# EAGLE design ControlLineSelector (EAGLE 7.5.0)
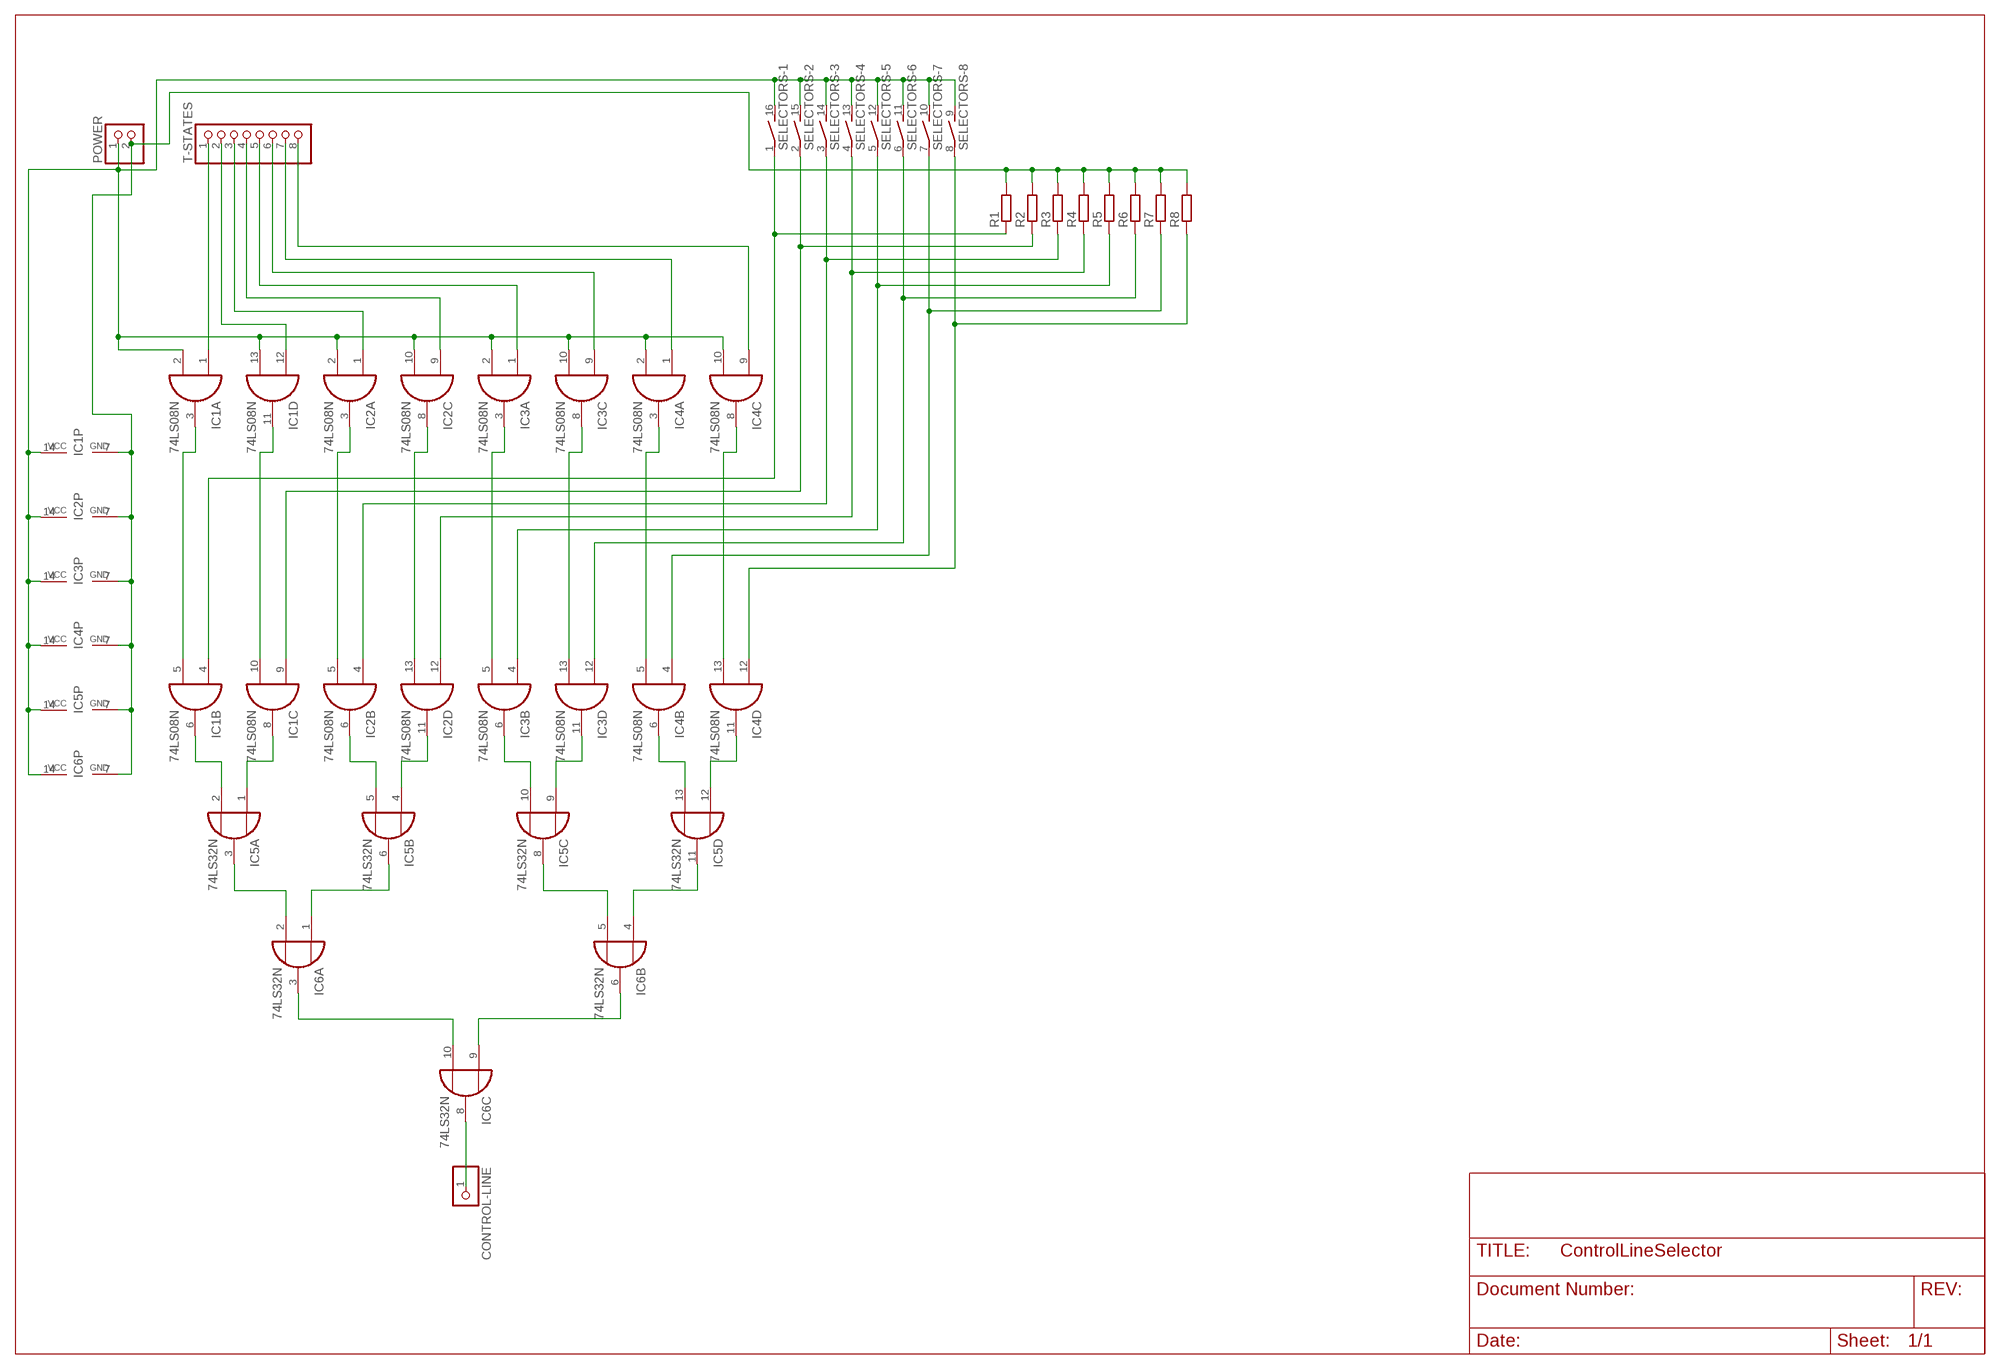
[diagram p0: schematic, sheet 1]

## Parts
CONTROL-LINE  PINHD-1X1  [1X01]
IC1  74LS08N  [DIL14]
IC2  74LS08N  [DIL14]
IC3  74LS08N  [DIL14]
IC4  74LS08N  [DIL14]
IC5  74LS32N  [DIL14]
IC6  74LS32N  [DIL14]
POWER  PINHD-1X2  [1X02]
R1  R-EU_0207/7  [0207/7]
R2  R-EU_0207/7  [0207/7]
R3  R-EU_0207/7  [0207/7]
R4  R-EU_0207/7  [0207/7]
R5  R-EU_0207/7  [0207/7]
R6  R-EU_0207/7  [0207/7]
R7  R-EU_0207/7  [0207/7]
R8  R-EU_0207/7  [0207/7]
SELECTORS  DIP08S  [DIP08S]
T-STATES  PINHD-1X8  [1X08]

## Nets
GND: IC1.7(P:GND) IC2.7(P:GND) IC3.7(P:GND) IC4.7(P:GND) IC5.7(P:GND) IC6.7(P:GND) POWER.2 R1.2 R2.2 R3.2 R4.2 R5.2 R6.2 R7.2 R8.2
N$1: IC1.3(A:O) IC1.5(B:I1)
N$2: IC1.1(A:I0) T-STATES.1
N$3: IC1.4(B:I0) R1.1 SELECTORS.1
N$4: IC1.12(D:I0) T-STATES.2
N$5: IC4.1(A:I0) T-STATES.7
N$6: IC1.10(C:I1) IC1.11(D:O)
N$7: IC1.9(C:I0) R2.1 SELECTORS.2
N$8: IC4.9(C:I0) T-STATES.8
N$9: IC2.3(A:O) IC2.5(B:I1)
N$10: IC2.8(C:O) IC2.13(D:I1)
N$11: IC3.3(A:O) IC3.5(B:I1)
N$12: IC2.1(A:I0) T-STATES.3
N$13: IC2.9(C:I0) T-STATES.4
N$14: IC3.1(A:I0) T-STATES.5
N$15: IC3.9(C:I0) T-STATES.6
N$16: IC3.8(C:O) IC3.13(D:I1)
N$17: IC4.3(A:O) IC4.5(B:I1)
N$18: IC4.8(C:O) IC4.13(D:I1)
N$19: IC2.4(B:I0) R3.1 SELECTORS.3
N$21: IC3.4(B:I0) R5.1 SELECTORS.5
N$22: IC3.12(D:I0) R6.1 SELECTORS.6
N$23: IC4.4(B:I0) R7.1 SELECTORS.7
N$24: IC4.12(D:I0) R8.1 SELECTORS.8
N$25: IC1.6(B:O) IC5.2(A:I1)
N$26: IC1.8(C:O) IC5.1(A:I0)
N$27: IC2.6(B:O) IC5.5(B:I1)
N$28: IC2.11(D:O) IC5.4(B:I0)
N$29: IC3.6(B:O) IC5.10(C:I1)
N$30: IC3.11(D:O) IC5.9(C:I0)
N$31: IC4.6(B:O) IC5.13(D:I1)
N$32: IC4.11(D:O) IC5.12(D:I0)
N$33: IC5.3(A:O) IC6.2(A:I1)
N$34: IC5.6(B:O) IC6.1(A:I0)
N$35: IC5.8(C:O) IC6.5(B:I1)
N$36: IC5.11(D:O) IC6.4(B:I0)
N$37: IC6.3(A:O) IC6.10(C:I1)
N$38: IC6.6(B:O) IC6.9(C:I0)
N$39: CONTROL-LINE.1 IC6.8(C:O)
N$42: IC2.12(D:I0) R4.1 SELECTORS.4
VCC: IC1.2(A:I1) IC1.13(D:I1) IC1.14(P:VCC) IC2.2(A:I1) IC2.10(C:I1) IC2.14(P:VCC) IC3.2(A:I1) IC3.10(C:I1) IC3.14(P:VCC) IC4.2(A:I1) IC4.10(C:I1) IC4.14(P:VCC) IC5.14(P:VCC) IC6.14(P:VCC) POWER.1 SELECTORS.9 SELECTORS.10 SELECTORS.11 SELECTORS.12 SELECTORS.13 SELECTORS.14 SELECTORS.15 SELECTORS.16
Unconnected: IC6.11(D:O) IC6.12(D:I0) IC6.13(D:I1)

## Library data of the parts
CONTROL-LINE = pinhead:PINHD-1X1: PIN HEADER
IC1-IC4 = 74xx-eu:74*08: Quad 2-input AND gate
IC5 IC6 = 74xx-eu:74*32: Quad 2-input OR gate
POWER = pinhead:PINHD-1X2: PIN HEADER
R1-R8 = rcl:R-EU_: RESISTOR, European symbol
SELECTORS = switch-dil:DIP08S: DIL/CODE SWITCH; OC_FARNELL: unknown; OC_NEWARK: unknown
T-STATES = pinhead:PINHD-1X8: PIN HEADER

## Board
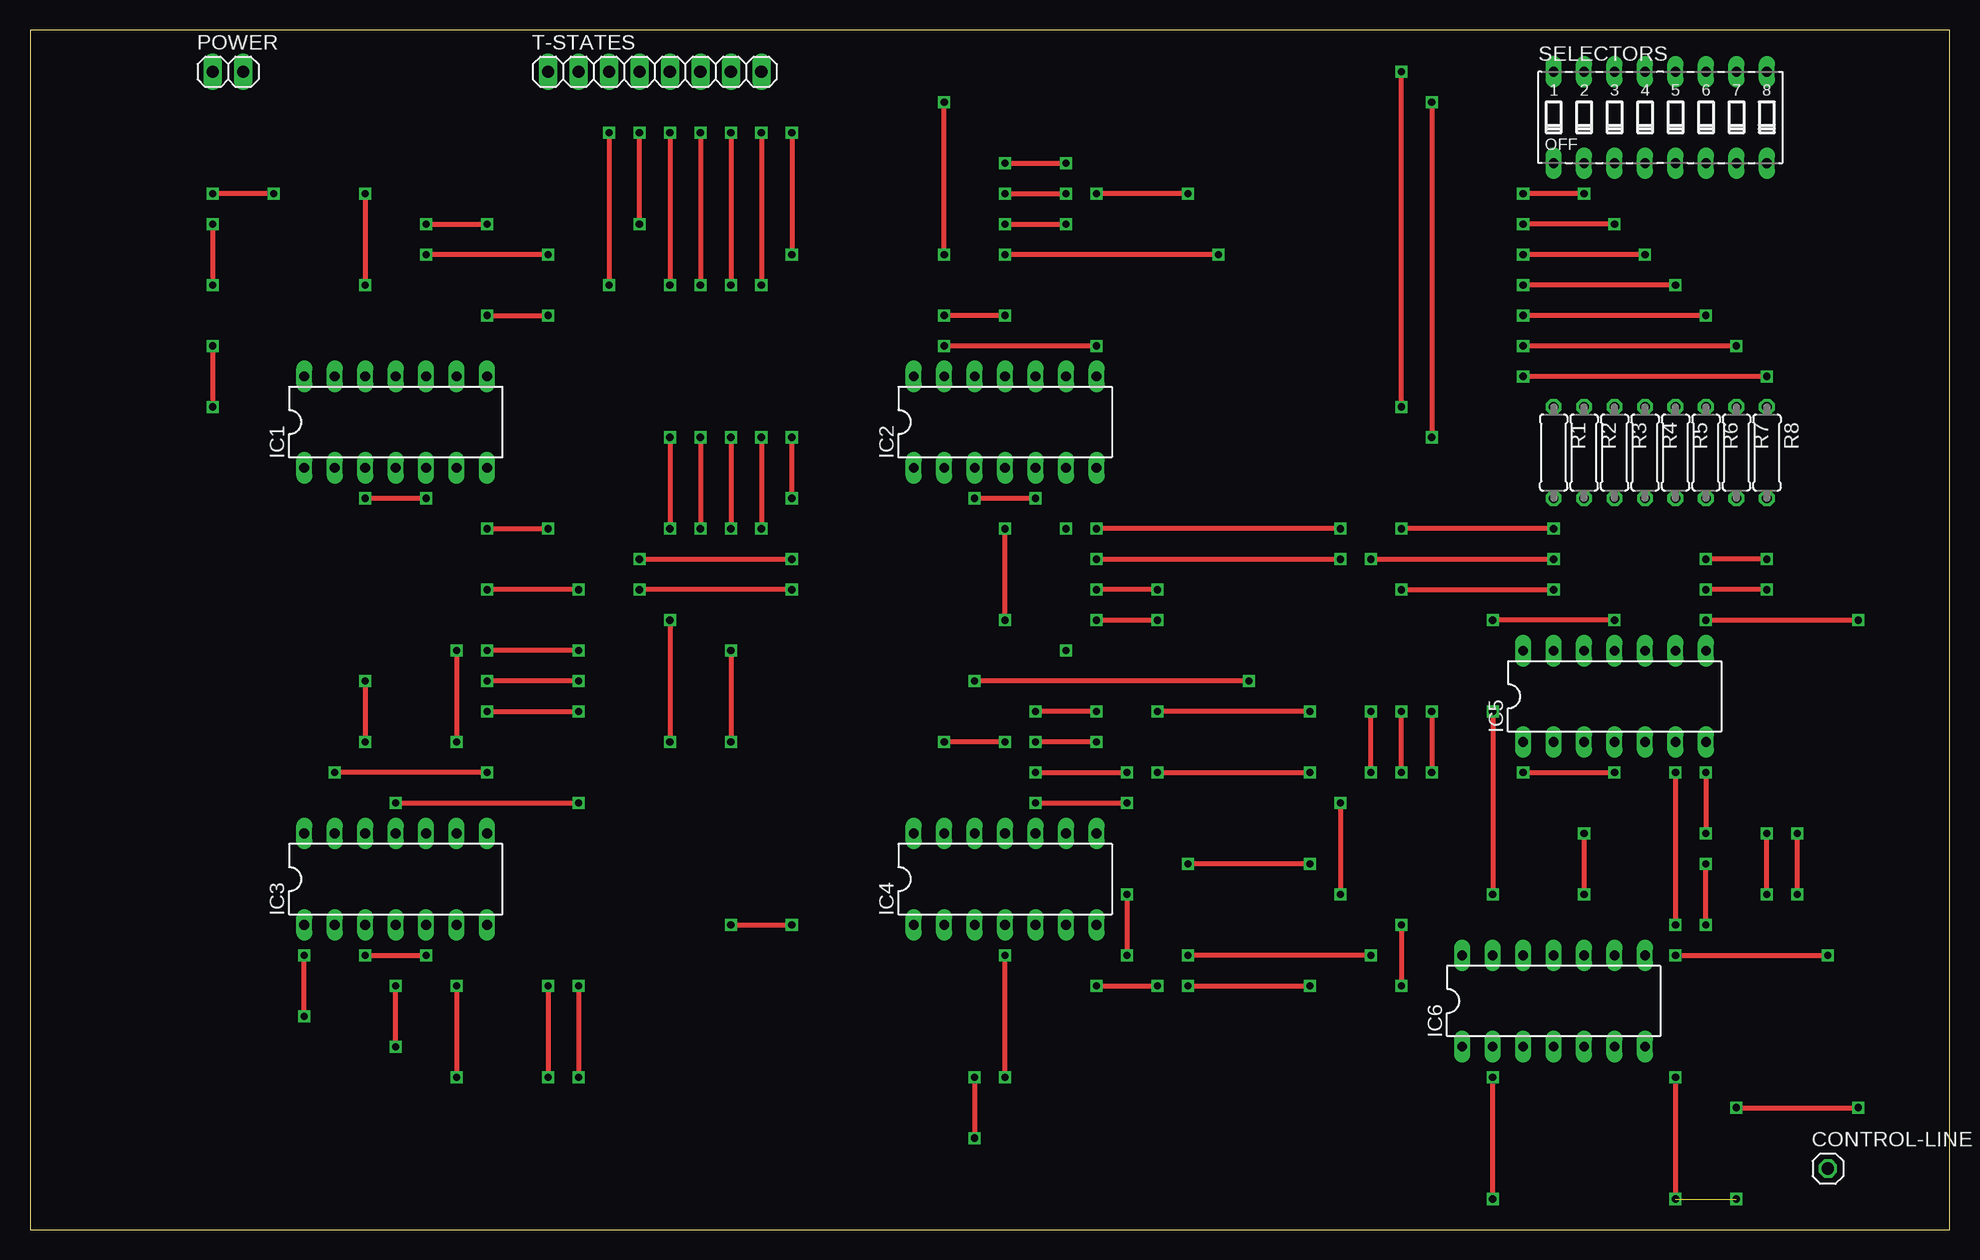
[diagram p1: board, top side]
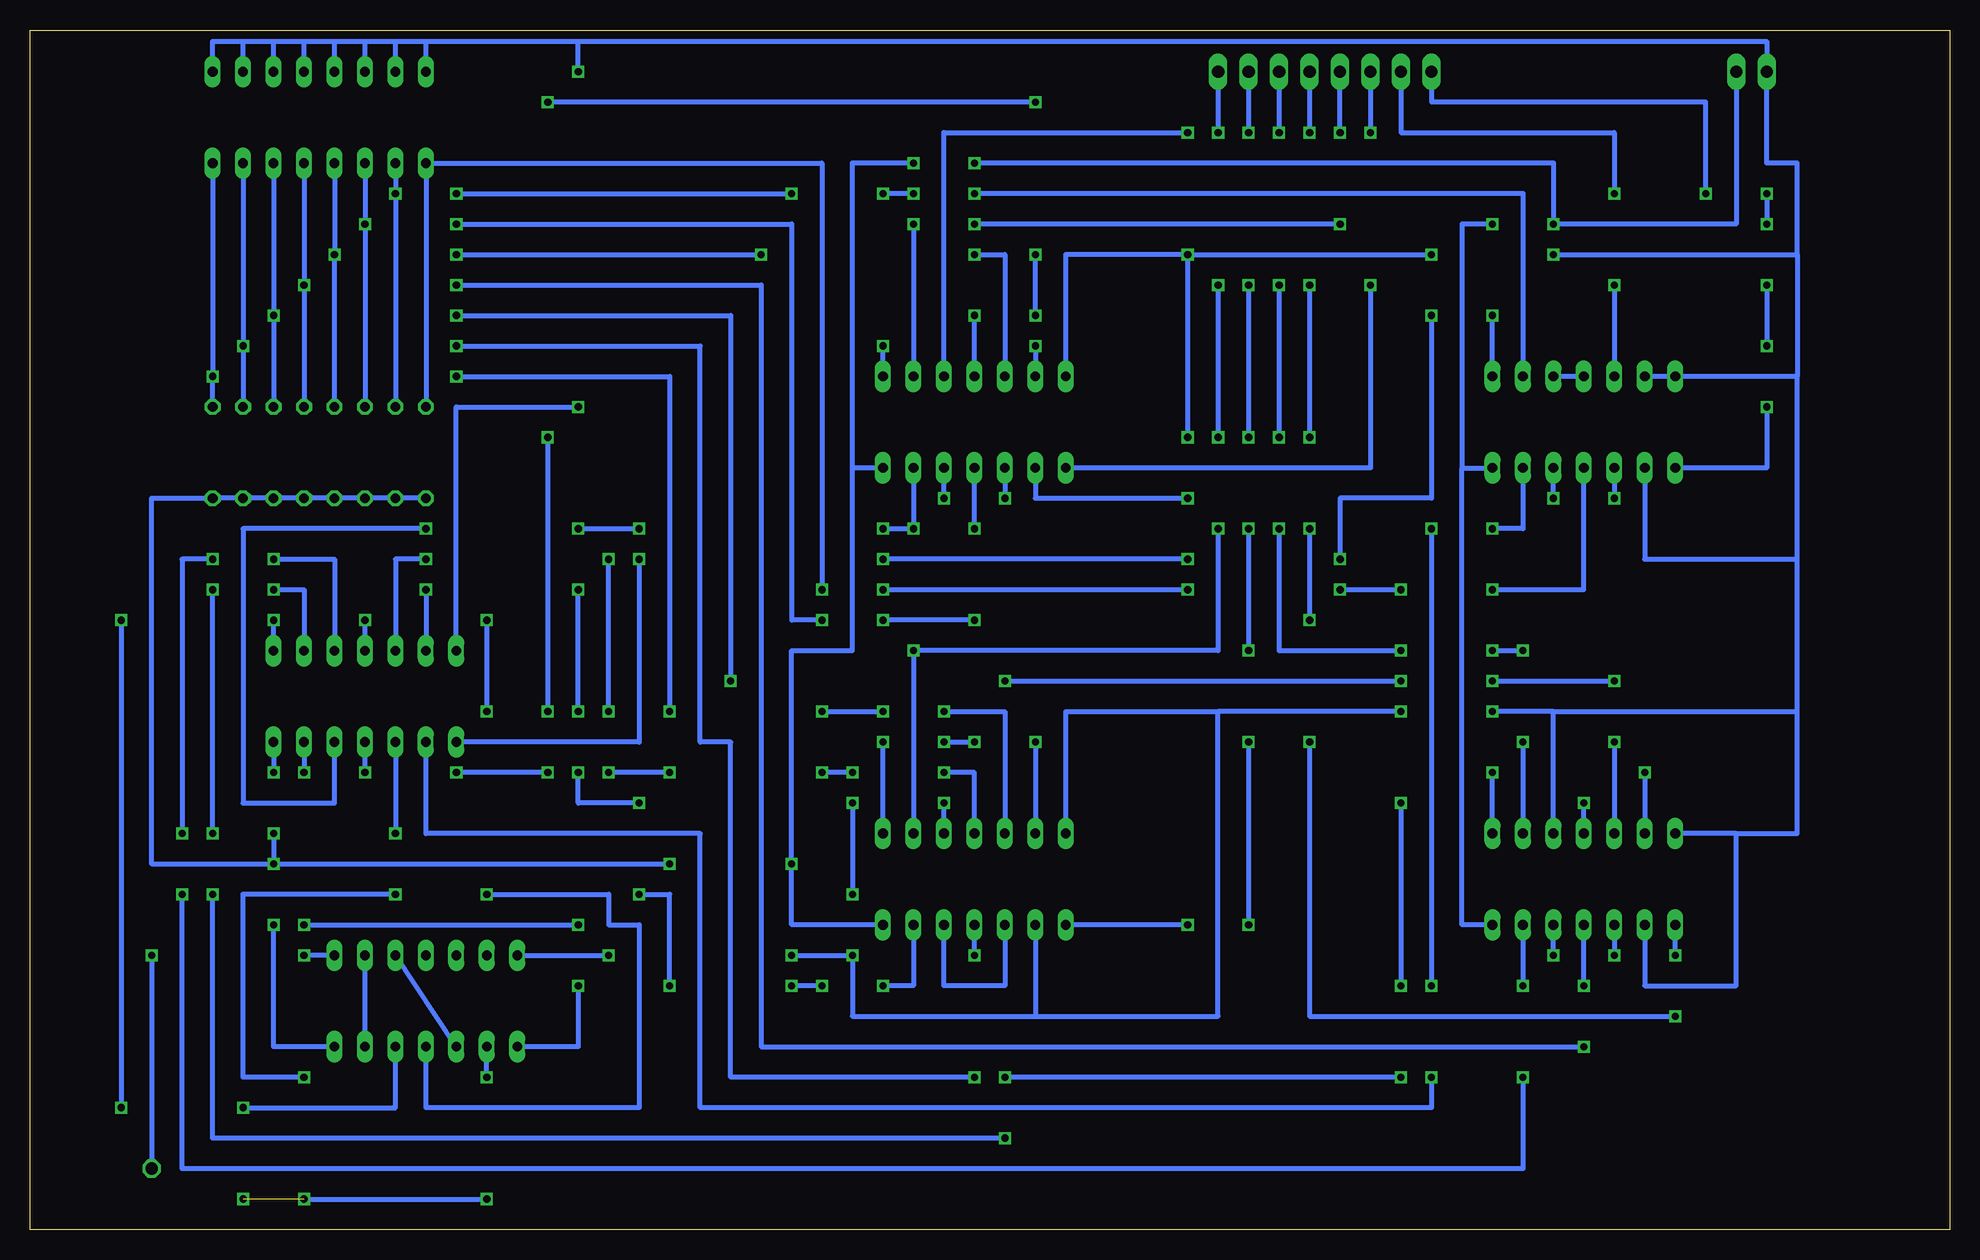
[diagram p2: board, bottom side, seen from below]

Size 160 x 100 mm. Coordinates in mm from the lower left corner, seen from the top.
Outline: 0,0 160,0 160,100 0,100 0,0
Copper layers (1*16): Top 0.035mm / dielectric 1.5mm / Bottom 0.035mm
Design rules "default": minimum track width 10mil, minimum drill 24mil, track to track 8mil, track to pad 8mil, pad to pad 8mil, via to via 8mil, smd to smd 8mil, copper to edge 40mil, drill to drill 8mil, minimum pad ring 10mil, minimum via ring 8mil, stop-mask expansion 4mil, vias tented up to drill 0mil, thermal gap 10mil

### Footprints (pad centres in the part's own frame; a part is rotated, then mirrored left to right if it is on the bottom)
1X01 = drill 1.016 octagon: 1 0,0
DIL14 = drill 0.813 long: 1 -7.62,-3.81; 2 -5.08,-3.81; 3 -2.54,-3.81; 4 0,-3.81; 5 2.54,-3.81; 6 5.08,-3.81; 7 7.62,-3.81; 8 7.62,3.81; 9 5.08,3.81; 10 2.54,3.81; 11 0,3.81; 12 -2.54,3.81; 13 -5.08,3.81; 14 -7.62,3.81
1X02 = drill 1.016 long: 1 -1.27,0; 2 1.27,0
0207/7 = drill 0.813 octagon: 1 -3.81,0; 2 3.81,0
DIP08S = drill 0.813 long: 1 -8.89,-3.81; 2 -6.35,-3.81; 3 -3.81,-3.81; 4 -1.27,-3.81; 5 1.27,-3.81; 6 3.81,-3.81; 7 6.35,-3.81; 8 8.89,-3.81; 9 8.89,3.81; 10 6.35,3.81; 11 3.81,3.81; 12 1.27,3.81; 13 -1.27,3.81; 14 -3.81,3.81; 15 -6.35,3.81; 16 -8.89,3.81
1X08 = drill 1.016 long: 1 -8.89,0; 2 -6.35,0; 3 -3.81,0; 4 -1.27,0; 5 1.27,0; 6 3.81,0; 7 6.35,0; 8 8.89,0

### Placement (x,y rotation side)
CONTROL-LINE  149.86,5.08 0 top
IC1  30.48,67.31 0 top
IC2  81.28,67.31 0 top
IC3  30.48,29.21 0 top
IC4  81.28,29.21 0 top
IC5  132.08,44.45 0 top
IC6  127,19.05 0 top
POWER  16.51,96.52 0 top
R1  127,64.77 270 top
R2  129.54,64.77 270 top
R3  132.08,64.77 270 top
R4  134.62,64.77 270 top
R5  137.16,64.77 270 top
R6  139.7,64.77 270 top
R7  142.24,64.77 270 top
R8  144.78,64.77 270 top
SELECTORS  135.89,92.71 0 top
T-STATES  52.07,96.52 0 top

### Tracks (layer width: path | path; a pad name or v marks a point on that pad's centre or on a via)
GND  (via drill 0.6)
  Top 0.406: v33.02,83.82 v38.1,83.82 | v81.28,88.9 v86.36,88.9 | v139.7,38.1 v139.7,33.02 | v106.68,30.48 v96.52,30.48 | v139.7,25.4 v139.7,30.48
  Bottom 0.406: POWER.2 17.78,83.82 v33.02,83.82 33.02,88.9 v81.28,88.9 | v38.1,83.82 40.64,83.82 40.64,63.5 | 40.64,63.5 IC1.7 | IC2.7 91.44,63.5 | 91.44,63.5 91.44,88.9 v86.36,88.9 | IC4.7 96.52,25.4 v96.52,30.48 96.52,48.26 91.44,48.26 91.44,63.5 | IC3.7 40.64,25.4 40.64,63.5 | IC5.7 v139.7,38.1 | v139.7,33.02 v139.7,30.48 | v139.7,30.48 v106.68,30.48 | R1.2 R2.2 R3.2 R4.2 R5.2 R6.2 R7.2 R8.2 149.86,60.96 149.86,30.48 v139.7,30.48 | IC6.7 139.7,15.24 v139.7,25.4
N$1  (via drill 0.6)
  Top 0.406: v27.94,60.96 v33.02,60.96
  Bottom 0.406: IC1.3 v27.94,60.96 | v33.02,60.96 IC1.5
N$2  (via drill 0.6)
  Top 0.406: v15.24,83.82 v15.24,78.74 | v15.24,73.66 v15.24,68.58 | v20.32,86.36 v15.24,86.36
  Bottom 0.406: T-STATES.1 43.18,93.98 20.32,93.98 v20.32,86.36 | v15.24,86.36 v15.24,83.82 | v15.24,78.74 v15.24,73.66 | v15.24,68.58 15.24,63.5 IC1.1
N$3  (via drill 0.6)
  Top 0.406: v93.98,53.34 v88.9,53.34 | v63.5,53.34 v50.8,53.34 | v45.72,53.34 v38.1,53.34
  Bottom 0.406: v93.98,53.34 93.98,88.9 SELECTORS.1 R1.1 | v88.9,53.34 v63.5,53.34 | v50.8,53.34 v45.72,53.34 | v38.1,53.34 30.48,53.34 IC1.4
N$4  (via drill 0.6)
  Top 0.406: v27.94,86.36 v27.94,78.74
  Bottom 0.406: T-STATES.2 45.72,91.44 27.94,91.44 v27.94,86.36 | v27.94,78.74 IC1.12
N$5  (via drill 0.6)
  Top 0.406: v58.42,91.44 v58.42,78.74 | v58.42,66.04 v58.42,58.42 | v58.42,48.26 v58.42,40.64 | v58.42,25.4 v63.5,25.4
  Bottom 0.406: T-STATES.7 v58.42,91.44 | v58.42,78.74 v58.42,66.04 | v58.42,58.42 v58.42,48.26 | v58.42,40.64 v58.42,25.4 | v63.5,25.4 IC4.1
N$6
  Bottom 0.406: IC1.11 IC1.10
N$7  (via drill 0.6)
  Top 0.406: v129.54,86.36 v124.46,86.36 | v96.52,86.36 v88.9,86.36 | v81.28,86.36 v86.36,86.36
  Bottom 0.406: SELECTORS.2 v129.54,86.36 R2.1 | v124.46,86.36 v96.52,86.36 | IC1.9 35.56,86.36 v81.28,86.36 | v86.36,86.36 v88.9,86.36
N$8  (via drill 0.6)
  Top 0.406: v60.96,91.44 v60.96,78.74 | v60.96,66.04 v60.96,58.42
  Bottom 0.406: T-STATES.8 v60.96,91.44 | v60.96,78.74 v60.96,66.04 | v60.96,58.42 60.96,48.26 v86.36,48.26 IC4.9
N$9  (via drill 0.6)
  Top 0.406: v78.74,60.96 v83.82,60.96
  Bottom 0.406: IC2.3 v78.74,60.96 | v83.82,60.96 IC2.5
N$10  (via drill 0.6)
  Top 0.406: v88.9,73.66 v76.2,73.66
  Bottom 0.406: IC2.8 v88.9,73.66 | v76.2,73.66 IC2.13
N$11  (via drill 0.6)
  Top 0.406: v27.94,22.86 v33.02,22.86
  Bottom 0.406: IC3.3 v27.94,22.86 | v33.02,22.86 IC3.5
N$12  (via drill 0.6)
  Top 0.406: v48.26,91.44 v48.26,78.74
  Bottom 0.406: T-STATES.3 v48.26,91.44 | v48.26,78.74 48.26,63.5 IC2.1
N$13  (via drill 0.6)
  Top 0.406: v50.8,83.82 v50.8,91.44 | v81.28,83.82 v86.36,83.82
  Bottom 0.406: v86.36,83.82 IC2.9 | v50.8,91.44 T-STATES.4 | v50.8,83.82 v81.28,83.82
N$14  (via drill 0.6)
  Top 0.406: v53.34,91.44 v53.34,78.74 | v53.34,66.04 v53.34,58.42 | v53.34,50.8 v53.34,40.64 | v22.86,17.78 v22.86,22.86
  Bottom 0.406: T-STATES.5 v53.34,91.44 | v53.34,78.74 v53.34,66.04 | v53.34,58.42 v53.34,50.8 | v53.34,40.64 53.34,17.78 v22.86,17.78 | v22.86,22.86 IC3.1
N$15  (via drill 0.6)
  Top 0.406: v55.88,91.44 v55.88,78.74 | v55.88,66.04 v55.88,58.42 | v35.56,48.26 v35.56,40.64 | v45.72,48.26 v38.1,48.26
  Bottom 0.406: T-STATES.6 v55.88,91.44 | v55.88,78.74 v55.88,66.04 | v55.88,58.42 55.88,48.26 v45.72,48.26 | v35.56,40.64 IC3.9 | v38.1,48.26 v35.56,48.26
N$16  (via drill 0.6)
  Top 0.406: v38.1,38.1 v25.4,38.1
  Bottom 0.406: IC3.8 v38.1,38.1 | v25.4,38.1 IC3.13
N$17
  Bottom 0.406: IC4.3 78.74,20.32 83.82,20.32 IC4.5
N$18  (via drill 0.6)
  Top 0.406: v88.9,40.64 v83.82,40.64 | v81.28,40.64 v76.2,40.64
  Bottom 0.406: IC4.8 v88.9,40.64 | v83.82,40.64 v81.28,40.64 | v76.2,40.64 IC4.13
N$19  (via drill 0.6)
  Top 0.406: v132.08,83.82 v124.46,83.82 | v81.28,50.8 v81.28,58.42 | v88.9,50.8 v93.98,50.8
  Bottom 0.406: SELECTORS.3 v132.08,83.82 R3.1 | v124.46,83.82 96.52,83.82 96.52,50.8 v93.98,50.8 | v81.28,58.42 IC2.4 | v81.28,50.8 v88.9,50.8
N$21  (via drill 0.6)
  Top 0.406: v137.16,78.74 v124.46,78.74 | v30.48,15.24 v30.48,20.32
  Bottom 0.406: SELECTORS.5 v137.16,78.74 R5.1 | v124.46,78.74 99.06,78.74 99.06,15.24 v30.48,15.24 | v30.48,20.32 IC3.4
N$22  (via drill 0.6)
  Top 0.406: v139.7,76.2 v124.46,76.2 | v101.6,45.72 v78.74,45.72 | v27.94,45.72 v27.94,40.64 | v45.72,45.72 v38.1,45.72
  Bottom 0.406: SELECTORS.6 v139.7,76.2 R6.1 | v124.46,76.2 101.6,76.2 v101.6,45.72 | v27.94,40.64 IC3.12 | v78.74,45.72 v45.72,45.72 | v38.1,45.72 v27.94,45.72
N$23  (via drill 0.6)
  Top 0.406: v142.24,73.66 v124.46,73.66 | v81.28,12.7 v81.28,22.86
  Bottom 0.406: SELECTORS.7 v142.24,73.66 R7.1 | v124.46,73.66 104.14,73.66 104.14,40.64 101.6,40.64 101.6,12.7 v81.28,12.7 | v81.28,22.86 IC4.4
N$24  (via drill 0.6)
  Top 0.406: v144.78,71.12 v124.46,71.12 | v106.68,43.18 v93.98,43.18 | v88.9,43.18 v83.82,43.18
  Bottom 0.406: SELECTORS.8 v144.78,71.12 R8.1 | v124.46,71.12 106.68,71.12 v106.68,43.18 | v93.98,43.18 v88.9,43.18 | v83.82,43.18 78.74,43.18 IC4.12
N$25  (via drill 0.6)
  Top 0.406: v38.1,58.42 v43.18,58.42 | v43.18,20.32 v43.18,12.7
  Bottom 0.406: IC1.6 35.56,58.42 v38.1,58.42 | v43.18,58.42 v43.18,20.32 | v43.18,12.7 43.18,10.16 104.14,10.16 104.14,33.02 127,33.02 IC5.2
N$26  (via drill 0.6)
  Top 0.406: v38.1,76.2 v43.18,76.2 | v50.8,55.88 v63.5,55.88 | v88.9,55.88 v109.22,55.88
  Bottom 0.406: IC1.8 v38.1,76.2 | v43.18,76.2 43.18,60.96 50.8,60.96 v50.8,55.88 | v63.5,55.88 v88.9,55.88 | v109.22,55.88 109.22,40.64 IC5.1
N$27  (via drill 0.6)
  Top 0.406: v127,58.42 v114.3,58.42 | v109.22,58.42 v88.9,58.42
  Bottom 0.406: IC2.6 v86.36,58.42 v88.9,58.42 | v127,58.42 142.24,58.42 142.24,35.56 134.62,35.56 IC5.5 | v114.3,58.42 v109.22,58.42
N$28  (via drill 0.6)
  Top 0.406: v81.28,76.2 v76.2,76.2 | v76.2,81.28 v76.2,93.98 | v116.84,93.98 v116.84,66.04 | v116.84,43.18 v116.84,38.1 | v124.46,38.1 v132.08,38.1
  Bottom 0.406: IC2.11 v81.28,76.2 | v76.2,76.2 v76.2,81.28 | v76.2,93.98 v116.84,93.98 | v116.84,66.04 v116.84,43.18 | v116.84,38.1 v124.46,38.1 | v132.08,38.1 IC5.4
N$29  (via drill 0.6)
  Top 0.406: v35.56,20.32 v35.56,12.7 | v147.32,27.94 v147.32,33.02 | v144.78,55.88 v139.7,55.88
  Bottom 0.406: IC3.6 v35.56,20.32 | v35.56,12.7 35.56,5.08 147.32,5.08 v147.32,27.94 | v139.7,55.88 134.62,55.88 IC5.10 | v144.78,55.88 147.32,55.88 v147.32,33.02
N$30  (via drill 0.6)
  Top 0.406: v30.48,35.56 v45.72,35.56 | v45.72,20.32 v45.72,12.7 | v78.74,12.7 v78.74,7.62 | v144.78,27.94 v144.78,33.02 | v144.78,53.34 v139.7,53.34
  Bottom 0.406: IC3.11 v30.48,35.56 | v45.72,35.56 v45.72,20.32 | v45.72,12.7 v78.74,12.7 | v78.74,7.62 144.78,7.62 v144.78,27.94 | v139.7,53.34 137.16,53.34 IC5.9 | v144.78,33.02 v144.78,53.34
N$31  (via drill 0.6)
  Top 0.406: v88.9,20.32 v93.98,20.32 | v96.52,20.32 v106.68,20.32 | v114.3,38.1 v114.3,43.18 | v114.3,53.34 v127,53.34 | v109.22,35.56 v109.22,27.94
  Bottom 0.406: IC4.6 86.36,20.32 v88.9,20.32 | v93.98,20.32 v96.52,20.32 | v106.68,20.32 106.68,27.94 v109.22,27.94 | v114.3,43.18 v114.3,53.34 | v127,53.34 IC5.13 | v109.22,35.56 114.3,35.56 v114.3,38.1
N$32  (via drill 0.6)
  Top 0.406: v83.82,38.1 v91.44,38.1 | v93.98,38.1 v106.68,38.1 | v111.76,38.1 v111.76,43.18 | v111.76,55.88 v127,55.88
  Bottom 0.406: IC4.11 81.28,38.1 v83.82,38.1 | v91.44,38.1 v93.98,38.1 | v106.68,38.1 v111.76,38.1 | v111.76,43.18 v111.76,55.88 | v127,55.88 129.54,55.88 IC5.12
N$33  (via drill 0.6)  (1 unrouted)
  Top 0.406: v129.54,33.02 v129.54,27.94 | v121.92,2.54 v121.92,12.7 | v137.16,12.7 v137.16,2.54
  Bottom 0.406: IC5.3 v129.54,33.02 | v129.54,27.94 142.24,27.94 142.24,12.7 v137.16,12.7 | v121.92,12.7 IC6.2 | v137.16,2.54 v121.92,2.54
  other vias: 142.24,2.54
N$34  (via drill 0.6)
  Top 0.406: v137.16,38.1 v137.16,25.4 | v114.3,25.4 v114.3,20.32
  Bottom 0.406: IC5.6 v137.16,38.1 | v137.16,25.4 v114.3,25.4 | v114.3,20.32 114.3,15.24 IC6.1
N$35  (via drill 0.6)
  Top 0.406: v139.7,50.8 v152.4,50.8 | v142.24,10.16 v152.4,10.16
  Bottom 0.406: IC5.8 v139.7,50.8 | v152.4,50.8 v152.4,10.16 | v142.24,10.16 129.54,10.16 IC6.5
N$36  (via drill 0.6)
  Top 0.406: v132.08,50.8 v121.92,50.8 | v121.92,43.18 v121.92,27.94
  Bottom 0.406: IC5.11 v132.08,50.8 | v121.92,50.8 v121.92,43.18 | v121.92,27.94 111.76,27.94 111.76,25.4 109.22,25.4 109.22,10.16 127,10.16 IC6.4
N$37
  Bottom 0.406: IC6.3 IC6.10
N$38
  Bottom 0.406: IC6.6 IC6.9
N$39  (via drill 0.6)
  Top 0.406: v137.16,22.86 v149.86,22.86
  Bottom 0.406: IC6.8 v137.16,22.86 | v149.86,22.86 CONTROL-LINE.1
N$42  (via drill 0.6)
  Top 0.406: v134.62,81.28 v124.46,81.28 | v99.06,81.28 v81.28,81.28
  Bottom 0.406: SELECTORS.4 v134.62,81.28 R4.1 | v124.46,81.28 v99.06,81.28 | v81.28,81.28 78.74,81.28 IC2.12
VCC  (via drill 0.6)
  Top 0.406: v63.5,60.96 v63.5,66.04 | v83.82,35.56 v91.44,35.56 | v91.44,27.94 v91.44,22.86 | v38.1,43.18 v45.72,43.18 | v63.5,91.44 v63.5,81.28 | v114.3,68.58 v114.3,96.52 | v43.18,81.28 v33.02,81.28 | v111.76,22.86 v96.52,22.86
  Bottom 0.406: 12.7,81.28 12.7,71.12 | 12.7,71.12 IC1.14 IC1.13 | 17.78,33.02 12.7,33.02 12.7,43.18 | 12.7,43.18 12.7,55.88 | 12.7,55.88 12.7,71.12 | IC2.14 73.66,81.28 v63.5,81.28 | IC4.14 73.66,43.18 60.96,43.18 | 33.02,43.18 12.7,43.18 | IC3.10 33.02,43.18 | IC3.2 25.4,20.32 17.78,20.32 17.78,33.02 | IC1.2 25.4,55.88 12.7,55.88 | IC4.2 76.2,17.78 | 76.2,17.78 60.96,17.78 60.96,43.18 | SELECTORS.9 144.78,99.06 142.24,99.06 | 142.24,99.06 139.7,99.06 | 139.7,99.06 137.16,99.06 | 137.16,99.06 134.62,99.06 | 134.62,99.06 132.08,99.06 | 132.08,99.06 129.54,99.06 | 129.54,99.06 127,99.06 | 127,99.06 114.3,99.06 | 114.3,99.06 15.24,99.06 POWER.1 15.24,88.9 12.7,88.9 12.7,81.28 | SELECTORS.10 142.24,99.06 | SELECTORS.11 139.7,99.06 | SELECTORS.12 137.16,99.06 | SELECTORS.13 134.62,99.06 | SELECTORS.14 132.08,99.06 | SELECTORS.15 129.54,99.06 | SELECTORS.16 127,99.06 | IC2.2 76.2,60.96 v63.5,60.96 | v63.5,66.04 v63.5,81.28 | IC4.10 v83.82,35.56 | v91.44,35.56 v91.44,27.94 | 76.2,17.78 91.44,17.78 v91.44,22.86 v96.52,22.86 | 33.02,43.18 v38.1,43.18 | v45.72,43.18 60.96,43.18 | IC2.10 83.82,91.44 v63.5,91.44 | IC5.14 124.46,68.58 v114.3,68.58 | v114.3,96.52 114.3,99.06 | v63.5,81.28 v43.18,81.28 | v33.02,81.28 12.7,81.28 | IC6.14 v111.76,22.86 | 17.78,33.02 IC3.14